# Altium schematic sheet POWER.SchDoc
size A
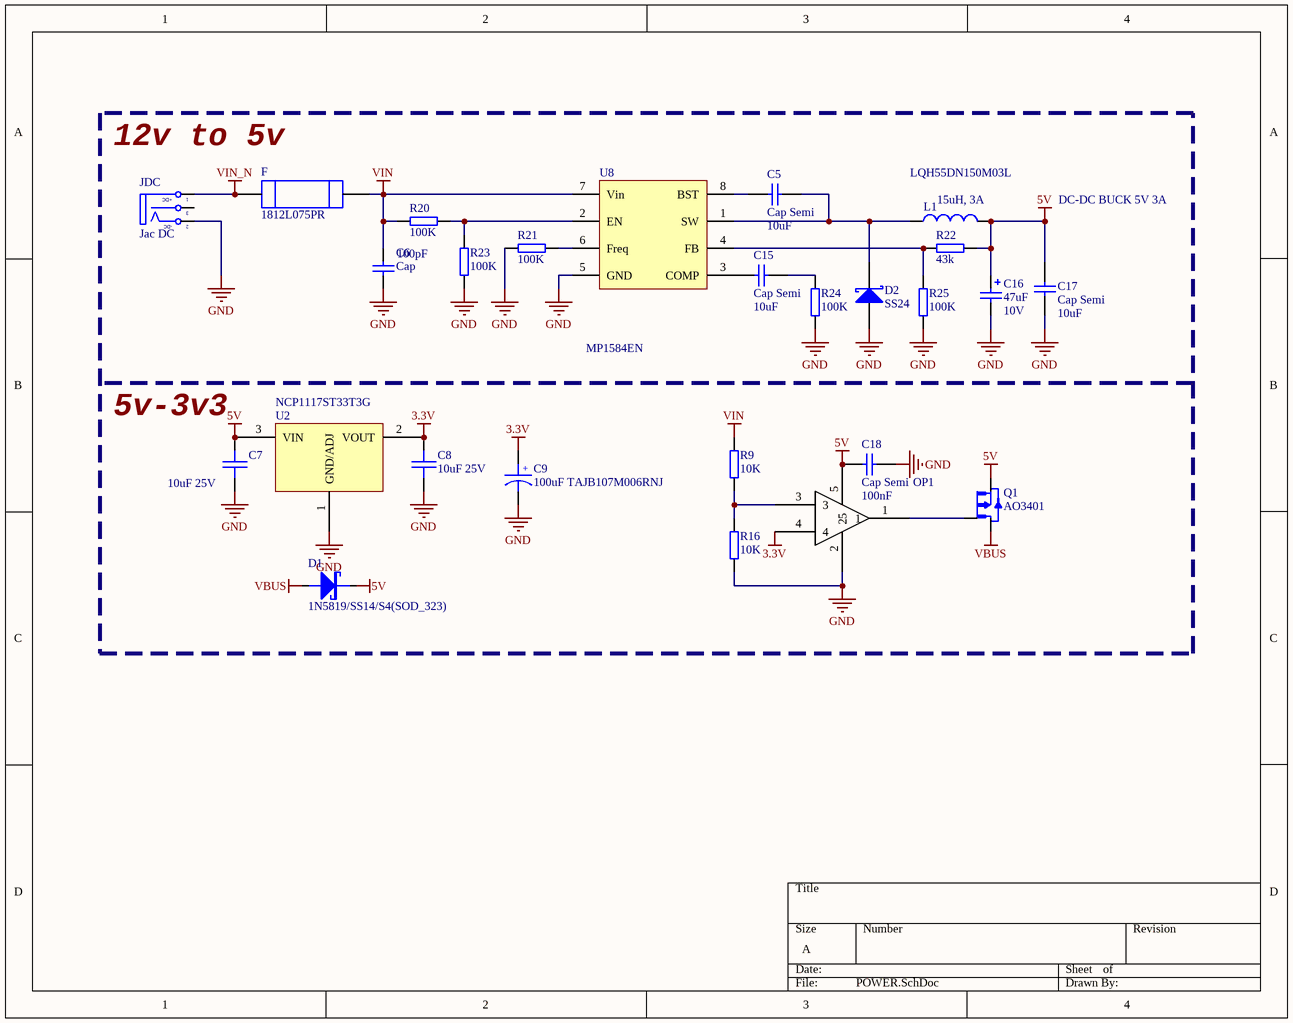
[diagram p0: POWER.SchDoc]

## Parts
C5  Cap Semi  value 10uF  [SMT0603]
C6  Cap  value 100pF  [CN-SMD-1206]
C7  10uF 25V  [SMT_C_0805]
C8  10uF 25V  [SMT_C_0805]
C9  100uF TAJB107M006RNJ  [SMT_C_Tantalum_B]
C15  Cap Semi  value 10uF  [SMT0603]
C16  47uF  Voltage: 10V  [Tantal_B]
C17  Cap Semi  value 10uF  [SMT0603]
C18  Cap Semi  value 100nF  [SMT0603]
D1  1N5819/SS14/S4(SOD_323)  [SMT_DIODE_SOD_323]
D2  SS24  [SMB]
F  1812L075PR  [1812]
JDC  Jac DC  [DC-IN]
L1  15uH, 3A  Marka: LQH55DN150M03L  [Inductor SMD 6.8*6.8*4.5]
OP1  Component_1  [SOT23-5]  (value not drawn)
Q1  AO3401  [SOT23]
R9  value 10K  [SMT0603]  (hidden comment: Resistor)
R16  value 10K  [SMT0603]  (hidden comment: Resistor)
R20  value 100K  [SMT0603]  (hidden comment: Resistor)
R21  value 100K  [SMT0603]  (hidden comment: Resistor)
R22  value 43k  [SMT0603]  (hidden comment: Resistor)
R23  value 100K  [SMT0603]  (hidden comment: Resistor)
R24  value 100K  [SMT0603]  (hidden comment: Resistor)
R25  value 100K  [SMT0603]  (hidden comment: Resistor)
U2  NCP1117ST33T3G  [SOT-223]
U8  MP1584EN  [SOIC127P600X170-9N]

## Nets
3.3V: C8.1 C9.1 OP1.4 U2.2(VOUT)
5V: C7.1 C16.1 C17.1 C18.1 D1.2(K) L1.2 OP1.5 Q1.2(S) R22.1 U2.3(VIN)
GND: C6.2 C7.2 C8.2 C9.2 C16.2 C17.2 C18.2 D2.1(A) JDC.2(TN) OP1.2 R16.1 R21.1 R23.2 R24.1 R25.2 U2.1(GND/ADJ) U8.5(GND)
VBUS: D1.1(A) Q1.3(D)
VIN: C6.1 F.2 R9.2 R20.1 U8.7(Vin)
VIN_N: F.1 JDC.1(T)
NetC5_1: C5.1 D2.2(K) L1.1 U8.1(SW)
NetC5_2: C5.2 U8.8(BST)
NetC15_1: C15.1 R24.2
NetC15_2: C15.2 U8.3(COMP)
NetOP1_1: OP1.1 Q1.1(G)
NetOP1_3: OP1.3 R9.1 R16.2
NetR20_2: R20.2 R23.1 U8.2(EN)
NetR21_2: R21.2 U8.6(Freq)
NetR22_2: R22.2 R25.1 U8.4(FB)

Not connected (* = marked no-connect by the designer): JDC 3(S)

## Notes on the sheet
- 12v to 5v
- DC-DC BUCK 5V 3A
- (near C7) 5v-3v3
- (in symbol DCIN) +DC; -DC
- (in symbol SMT_C_Tantalum_B) +

## Library data of the parts
C5 C15 C17 = CAP-SM-0603-X5R-10uF: CAP SM 0603 X5R 10uF 10%; Tolerance: ±10%; Supplier 1: Farnell; Supplier 2: Digi-Key; Supplier Part Number 1: 2366833; Supplier Part Number 2: 490-3896-1-ND
C6 = Cap: Capacitor; Published: 8-Jun-2000; LatestRevisionDate: 17-Jul-2002; LatestRevisionNote: Re-released for DXP Platform.; PackageReference: RAD-0.3; Publisher: Altium Limited; PackageDescription: Radial Cap, Thru-Hole; 2 Leads; 0.3 in Pin Spacing
C7 C8 = SMT_C_0805: Surface mount capacitor 0805
C9 = SMT_C_Tantalum_B: Capacitor, SM Tantalum; Body 3.5 x 2.8 mm (LxW typ)
C16 = Cap Pol: Polarized Capacitor (Axial); Published: 8-Jun-2000; LatestRevisionDate: 17-Jul-2002; LatestRevisionNote: Re-released for DXP Platform.; PackageReference: POLAR0.8; Publisher: Altium Limited; PackageDescription: Polarized Capacitor; 2 Leads; links: https://www.promelec.ru/product/327656/; price: 12.53
C18 = CAP-SM-0603-X7R-100nF: CAP SM 0603 X7R 100nF 10%; Tolerance: ±10%; Supplier 1: Digi-Key; Supplier 2: Farnell; Supplier Part Number 1: 490-3167-1-ND; Supplier Part Number 2: 1775994RL
D1 = SMT_DIODE_SCHOTTKY_SOD_323: Surface mount schottky diode SOD-323(0805) Package
D2 = D Schottky: Schottky Diode; Published: 8-Jun-2000; LatestRevisionDate: 17-Jul-2002; LatestRevisionNote: Re-released for DXP Platform.; PackageReference: SMB; Publisher: Altium Limited; PackageDescription: DO-214-AA/SMB; 2 C-Bend Leads; Body 5.3 x 3.6 mm, inc. leads (LxW); Code_JEDEC: DO-214-AA
F = 1812L075PR: Polymeric PTC Resettable Fuse 13.2V 750mA Ih Surface Mount 1812 _4532 Metric_, Concave; MF: Littelfuse Inc.; SnapEDA_Link: https://www.snapeda.com/parts/1812L075PR/Littelfuse%20Inc./view-part/46903/?ref=snap; MP: 1812L075PR; Availability: Unavailable; Price: None; Value: *; Package: 1812 Littelfuse
JDC = DCIN: Jac DC input; Value: Jac DC
L1 = Inductor: price: 68.07; links: https://www.promelec.ru/product/318749/
Q1 = AO3401: P-Channel 30V 4A _Ta_ 1.4W _Ta_ Surface Mount SOT-23-3; MF: Alpha & Omega Semiconductor; Value: *; MP: AO3401; SnapEDA_Link: https://www.snapeda.com/parts/AO3401/Alpha%20%26%20Omega%20Semiconductor/view-part/4592622/?ref=snap; Availability: Unavailable; Package: SOT-23-3 Alpha &amp; Omega Semiconductor; Price: None
R9 R16 = RES-SM-0603-10K: RES SM 0603 10K; Supplier 1: Farnell; Supplier 2: Digi-Key; Supplier Part Number 1: 9330399; Supplier Part Number 2: 541-10.0KHCT-ND
R20-R25 = RES-SM-0603-100K: RES SM 0603 100K; Supplier 1: Farnell; Supplier 2: Digi-Key; Supplier Part Number 1: 1344361; Supplier Part Number 2: 541-100KHCT-ND
U2 = NCP1117: NCP1117, NCV1117. 1.0 A Low-Dropout Positive  Fixed and Adjustable  Voltage Regulators
U8 = MP1584: price: 53.54; links: https://www.promelec.ru/product/318330/